# EAGLE design tree1 (EAGLE 9.6.0)
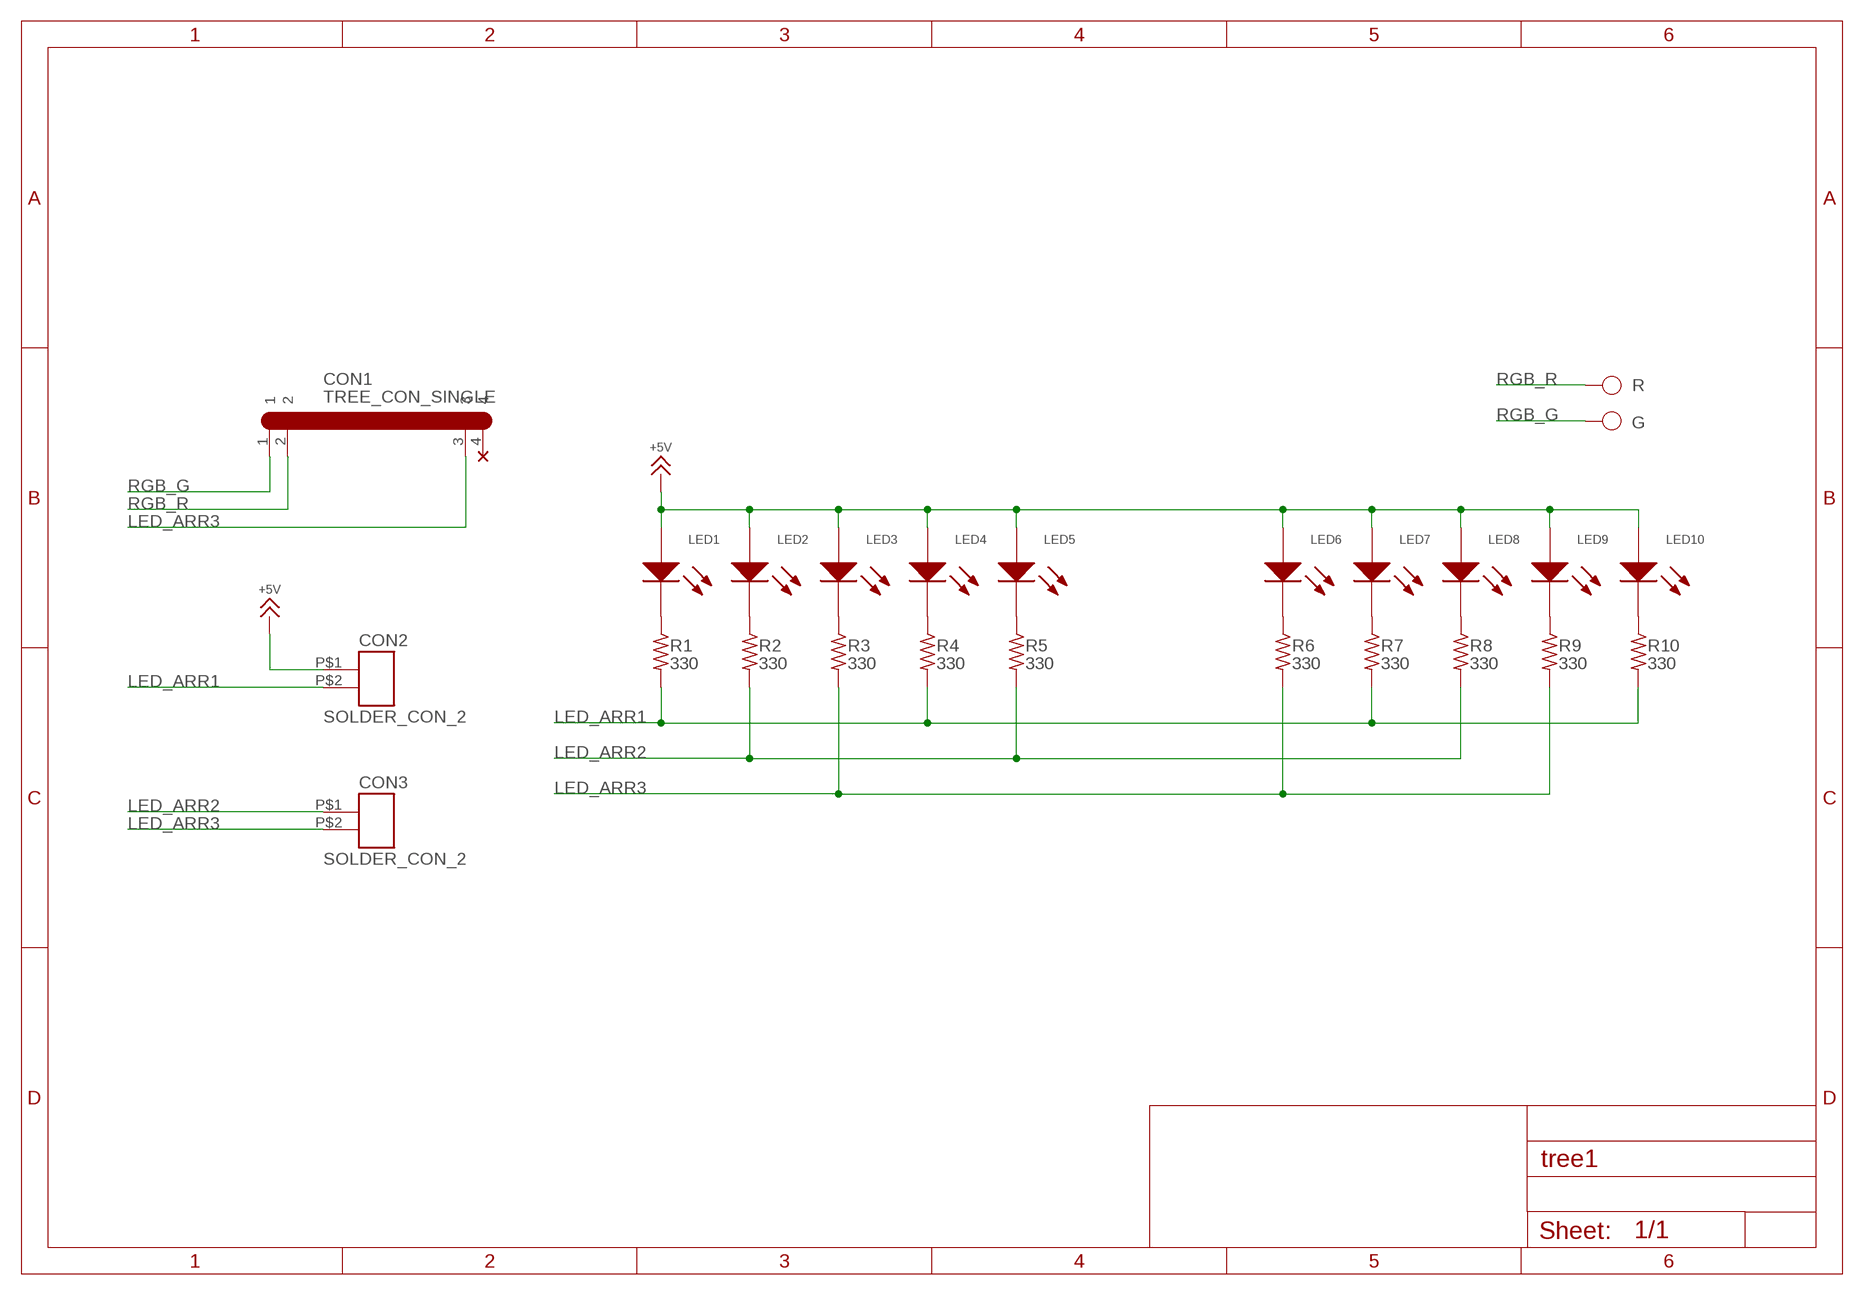
[diagram p0: schematic, sheet 1]

## Parts
CON1  TREE_CON_SINGLE  [TREE_CON_SINGLE]
CON2  SOLDER_CON_2  [SOLDER_CON_2]
CON3  SOLDER_CON_2  [SOLDER_CON_2]
G  TP  [TP]
LED1  LED_BEN  [LED_5MM_BEN]
LED2  LED_BEN  [LED_5MM_BEN]
LED3  LED_BEN  [LED_5MM_BEN]
LED4  LED_BEN  [LED_5MM_BEN]
LED5  LED_BEN  [LED_5MM_BEN]
LED6  LED_BEN  [LED_5MM_BEN]
LED7  LED_BEN  [LED_5MM_BEN]
LED8  LED_BEN  [LED_5MM_BEN]
LED9  LED_BEN  [LED_5MM_BEN]
LED10  LED_BEN  [LED_5MM_BEN]
R  TP  [TP]
R1  330  RES_2012  [SMD2012]
R2  330  RES_2012  [SMD2012]
R3  330  RES_2012  [SMD2012]
R4  330  RES_2012  [SMD2012]
R5  330  RES_2012  [SMD2012]
R6  330  RES_2012  [SMD2012]
R7  330  RES_2012  [SMD2012]
R8  330  RES_2012  [SMD2012]
R9  330  RES_2012  [SMD2012]
R10  330  RES_2012  [SMD2012]

## Nets
+5V [POWER]: CON2.P$1 LED1.1 LED2.1 LED3.1 LED4.1 LED5.1 LED6.1 LED7.1 LED8.1 LED9.1 LED10.1
LED_ARR1: CON2.P$2 R1.2 R4.2 R7.2 R10.2
LED_ARR2: CON3.P$1 R2.2 R5.2 R8.2
LED_ARR3: CON1.3 CON3.P$2 R3.2 R6.2 R9.2
N$1: LED1.2 R1.1
N$2: LED2.2 R2.1
N$3: LED3.2 R3.1
N$4: LED4.2 R4.1
N$5: LED5.2 R5.1
N$6: LED6.2 R6.1
N$7: LED7.2 R7.1
N$8: LED8.2 R8.1
N$9: LED9.2 R9.1
N$10: LED10.2 R10.1
RGB_G: CON1.1 G.1
RGB_R: CON1.2 R.1
Unconnected: CON1.4

## Library data of the parts
CON1 = !JKS:TREE_CON_SINGLE
CON2 CON3 = !JKS:SOLDER_CON_2
G R = !JKS:TP
LED1-LED10 = !JKS:LED
R1-R10 = !JKS:RES

## Net classes
0 default: width 0.254 mm
1 POWER: width 0.3 mm

## Board
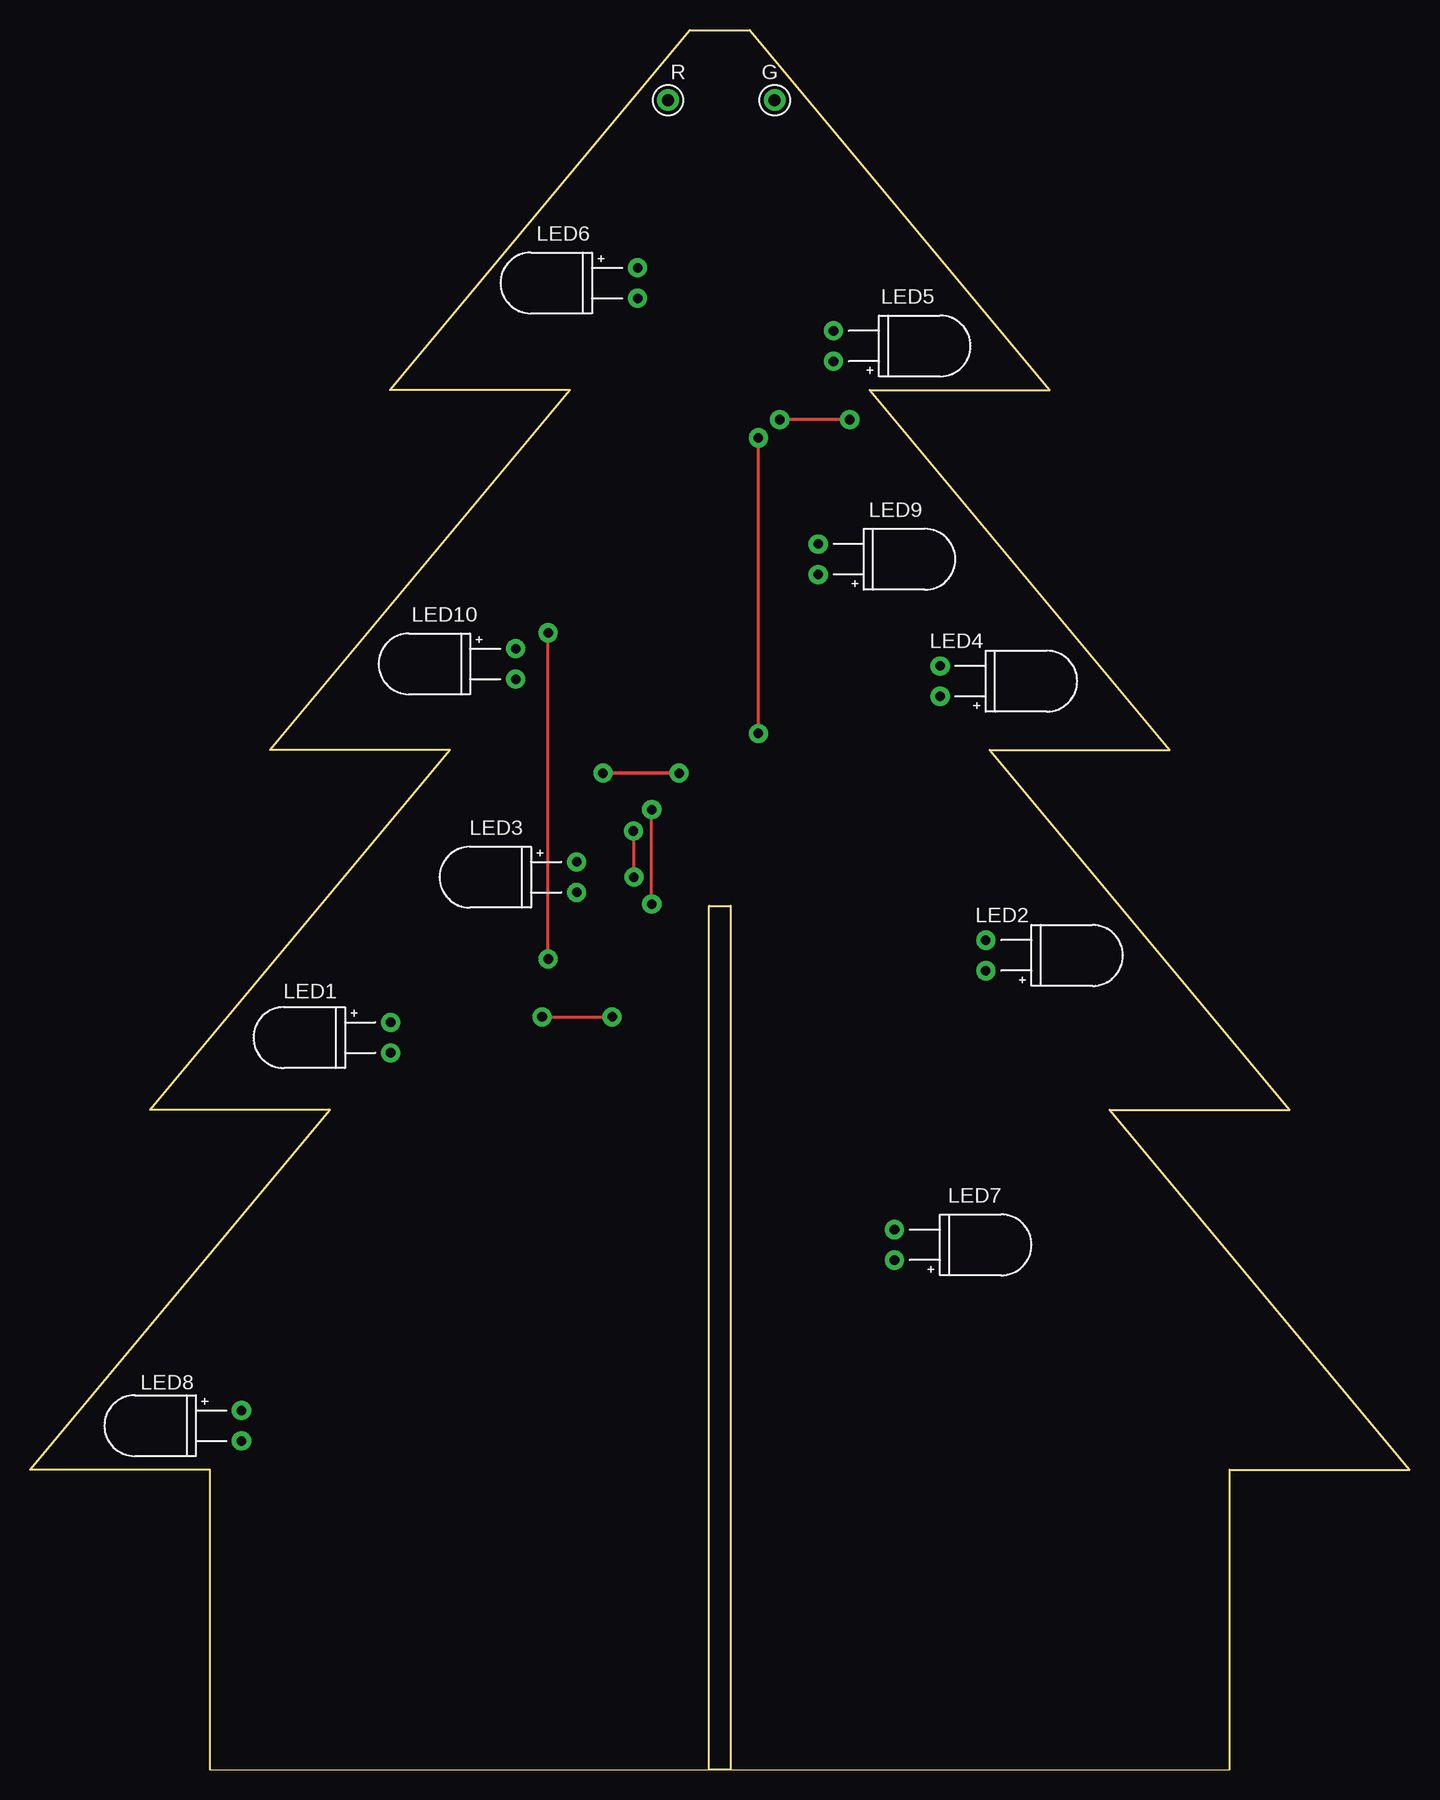
[diagram p1: board, top side]
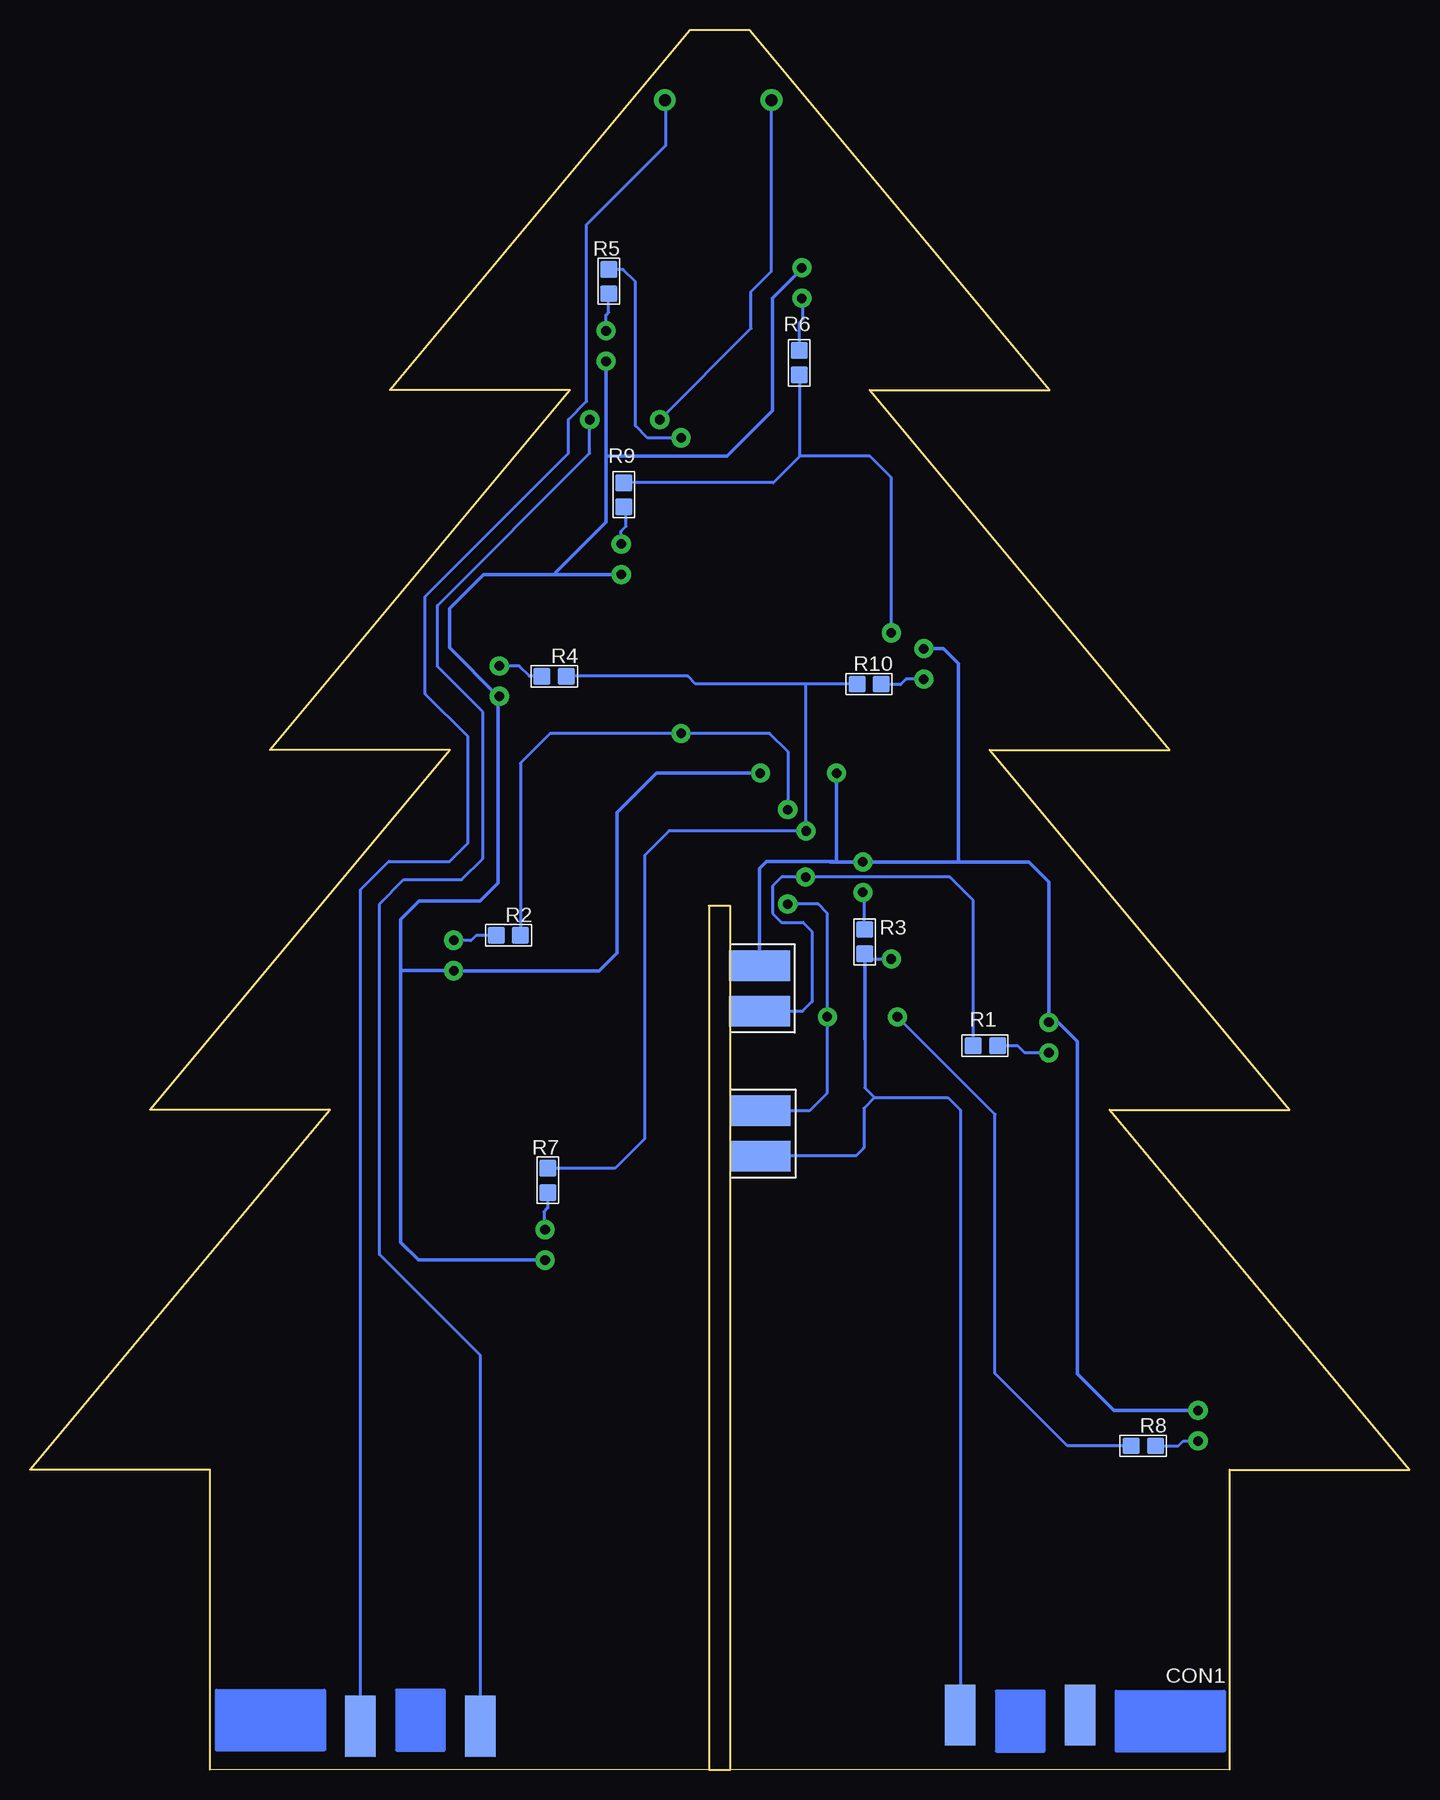
[diagram p2: board, bottom side, seen from below]

Size 115 x 145 mm. Coordinates in mm from the lower left corner, seen from the top.
Outline: 15,0 100,0 100,25 115,25 90,55 105,55 80,85 95,85 70,115 85,115 60,145 55,145 30,115 45,115 20,85 35,85 10,55 25,55 0,25 15,25 15,0
Copper layers (1*16): Top 0.035mm / dielectric 0.15mm / Bottom 0.035mm
Design rules "default *": minimum track width 10mil, minimum drill 0.35mm, track to track 10mil, track to pad 10mil, pad to pad 10mil, via to via 10mil, smd to smd 10mil, copper to edge 40mil, drill to drill 10mil, minimum pad ring 10mil, minimum via ring 8mil, stop-mask expansion 4mil, vias tented up to drill 0mil, thermal gap 10mil
Milling: 4 lines

### Footprints (pad centres in the part's own frame; a part is rotated, then mirrored left to right if it is on the bottom)
TREE_CON_SINGLE = smd 2.54 x 5.08: 1 -30,-3; 2 -20,-3; 3 20,-2.08; 4 30,-2.08
SOLDER_CON_2 = smd 2.54 x 5.08: P$1 0,0.635; P$2 3.81,0.635
TP = drill 1 pad 1.8: 1 0,0
LED_5MM_BEN = drill 0.8 pad 1.6: 1 0,0; 2 0,-2.54
SMD2012 = smd 1.4 x 1.4: 1 0,0; 2 2.019,0

### Placement (x,y rotation side)
CON1  57.45,6.62 0 bottom
CON2  54.81,67.02 270 bottom
CON3  54.76,54.92 270 bottom
G  62.08,139.15 0 top
LED1  30.06,62.28 0 top
LED2  79.68,66.59 180 top
LED3  45.57,75.65 0 top
LED4  75.87,89.45 180 top
LED5  66.98,117.39 180 top
LED6  50.65,125.18 0 top
LED7  72.06,42.46 180 top
LED8  17.63,29.93 0 top
LED9  65.71,99.61 180 top
LED10  40.49,93.43 0 top
R  53.19,139.15 0 top
R1  34.35,60.32 180 bottom
R2  76.13,69.54 0 bottom
R3  45.41,70.02 270 bottom
R4  72.32,91.13 0 bottom
R5  66.76,123.02 90 bottom
R6  50.87,118.28 270 bottom
R7  71.84,48.09 90 bottom
R8  21.18,26.98 180 bottom
R9  65.49,105.24 90 bottom
R10  44.04,90.48 180 bottom

### Tracks (layer width: path | path; a pad name or v marks a point on that pad's centre or on a via)
+5V  (via drill 0.8 pad 1.6)
  Top 0.3: v47.77,83.06 v54.12,83.06
  Bottom 0.3: 37.61,75.65 31.72,75.65 30.06,73.99 LED1.1 29.27,62.28 27.7,60.71 27.7,32.98 24.65,29.93 LED8.1 | 37.61,75.65 LED3.1 47.77,75.65 | LED10.1 38.83,93.43 37.61,92.2 37.61,75.65 | 66.94,117.35 LED5.1 66.98,109.47 | 47.77,75.65 48.02,75.65 | 48.02,75.65 48.32,75.65 | LED9.1 71.13,99.61 | 71.13,99.61 77.19,99.61 80.02,96.77 80.02,93.51 75.96,89.45 LED4.1 75.96,89.36 75.96,73.91 77.48,72.39 82.56,72.39 84.09,70.87 84.09,66.55 | LED7.1 82.61,42.46 84.09,43.94 84.09,66.55 | 84.09,66.55 84.05,66.59 LED2.1 79.64,66.55 67.58,66.55 66.05,68.07 66.05,79.76 62.75,83.06 v54.12,83.06 | 47.77,75.65 v47.77,83.06 | 66.98,109.47 66.98,103.98 71.13,99.82 71.13,99.61 | 66.98,109.47 56.91,109.47 53.1,113.28 53.1,122.64 50.65,125.09 LED6.1 | CON2.P$1 54.18,75.12 53.61,75.69 48.06,75.69 48.02,75.65
LED_ARR1  (via drill 0.8 pad 1.6)
  Top 0.254: v50.34,74.39 50.34,78.19 v50.31,78.23
  Bottom 0.254: R10.2 50.31,90.48 | 50.31,90.48 59.51,90.48 60.16,91.13 R4.2 | R1.2 36.37,72.42 38.33,74.39 v50.34,74.39 52.38,74.39 53.1,73.66 53.1,71.37 52.34,70.61 50.56,70.61 49.8,69.85 49.8,64.01 50.6,63.21 CON2.P$2 | 50.31,90.48 v50.31,78.23 61.74,78.23 63.77,76.2 63.77,52.58 66.24,50.11 R7.2
LED_ARR2  (via drill 0.8 pad 1.6)
  Top 0.254: v42.69,62.74 v48.53,62.74 | v60.72,86.36 v60.72,111 | v51.83,72.14 v51.83,80.01
  Bottom 0.254: R8.2 28.52,26.98 34.56,33.02 34.56,54.61 v42.69,62.74 | R2.2 74.11,83.89 71.64,86.36 v60.72,86.36 53.35,86.36 51.83,84.84 v51.83,80.01 | R5.2 65.55,125.04 64.53,124.02 64.53,112.01 63.51,111 v60.72,111 | CON3.P$1 49.99,54.92 48.53,56.39 v48.53,62.74 48.53,71.37 49.29,72.14 v51.83,72.14
LED_ARR3  (via drill 0.8 pad 1.6)
  Top 0.254: v43.19,67.56 v43.19,94.74
  Bottom 0.254: CON1.3 37.45,54.97 38.5,56.01 44.59,56.01 | 45.41,60.82 R3.2 | R6.2 50.87,109.42 | R9.2 53.03,107.26 50.87,109.42 | R3.2 44.97,67.56 v43.19,67.56 | v43.19,94.74 43.19,107.7 44.97,109.47 50.81,109.47 50.87,109.42 | R3.2 45.41,56.83 44.59,56.01 | 44.59,56.01 45.48,55.12 45.48,51.82 46.11,51.18 54.06,51.18 CON3.P$2
N$1
  Bottom 0.254: LED1.2 32.07,59.74 32.65,60.32 R1.1
N$2
  Bottom 0.254: R2.1 77.79,69.54 78.25,69.09 79.64,69.09 LED2.2
N$3
  Bottom 0.254: R3.1 45.48,70.09 45.48,73.02 LED3.2
N$4
  Bottom 0.254: R4.1 73.36,91.13 74.22,91.99 LED4.2
N$5
  Bottom 0.254: LED5.2 66.98,121.25 66.76,121.47 R5.1
N$6
  Bottom 0.254: R6.1 50.87,120.59 50.56,120.9 50.56,122.55 LED6.2
N$7
  Bottom 0.254: R7.1 71.84,46.79 72.15,46.48 72.15,45.09 LED7.2
N$8
  Bottom 0.254: LED8.2 18.85,27.39 19.26,26.98 R8.1
N$9
  Bottom 0.254: LED9.2 65.71,103.21 65.29,103.63 65.29,105.04 R9.1
N$10
  Bottom 0.254: LED10.2 41.97,90.89 42.43,90.42 43.98,90.42 R10.1
RGB_G
  Bottom 0.254: CON1.1 87.45,73.34 85.1,75.69 80.02,75.69 78.5,77.22 78.5,86.11 82.06,89.66 82.06,97.79 70.12,109.73 70.12,112.52 68.59,114.05 68.59,128.78 61.99,135.38 61.99,139.06 G.1
RGB_R  (via drill 0.8 pad 1.6)
  Top 0.254: v68.34,112.52 v62.5,112.52
  Bottom 0.254: CON1.2 77.45,34.51 85.87,42.93 85.87,72.14 83.83,74.17 79.01,74.17 77.23,75.95 77.23,88.14 81.04,91.95 81.04,97.03 68.34,109.73 v68.34,112.52 | R.1 53.19,124.88 54.88,123.19 54.88,120.14 v62.5,112.52